# Altium schematic sheet LPCB235 - OPTONCDT - GROUP B.SchDoc
size A3; Address1: Factory 10; Address2: 9-13 Dingley Avenue, Dandeong, VICTORIA 3175, AUSTRALIA; DocumentNumber: 35; Revision: 1; SheetNumber: 35; SheetTotal: 37; Lockie__PCB_SUB_ASSEMBLY: OptoNCDT Group B; Lockie__PCB_ASSEMBLY: FCU PCB; Lockie__LDL: LPCB235; Lockie__PCB_DESCRIPTION: Flight Control Unit
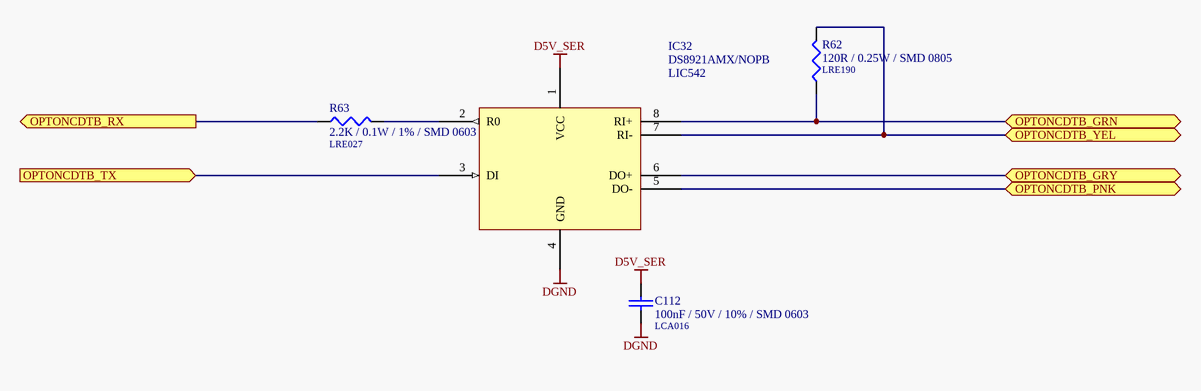
[diagram p0: LPCB235 - OPTONCDT - GROUP B.SchDoc]

## Parts
C112  100nF / 50V / 10% / SMD 0603  LDL_NUMBER: LCA016  [LFP011__CC1608-0603-IPC7351_B]
IC32  DS8921AMX/NOPB  LDL_NUMBER: LIC542  [LFP069__R-8G]
R62  120R / 0.25W / SMD 0805  LDL_NUMBER: LRE190  [LFP029__CR2012-0805]
R63  2.2K / 0.1W / 1% / SMD 0603  LDL_NUMBER: LRE027  [LFP020__CR1608-0603-IPC7351_B]

## Ports
OPTONCDTB_GRN (bidir), OPTONCDTB_GRY (bidir), OPTONCDTB_PNK (bidir), OPTONCDTB_RX (out), OPTONCDTB_TX (in), OPTONCDTB_YEL (bidir)

## Nets
D5V_SER: C112.1 IC32.1(VCC)
DGND: C112.2 IC32.4(GND)
OPTONCDTB_GRN: IC32.8(RI+) R62.1 ; port OPTONCDTB_GRN
OPTONCDTB_GRY: IC32.6(DO+) ; port OPTONCDTB_GRY
OPTONCDTB_PNK: IC32.5(DO-) ; port OPTONCDTB_PNK
OPTONCDTB_RX: R63.1 ; port OPTONCDTB_RX
OPTONCDTB_TX: IC32.3(DI) ; port OPTONCDTB_TX
OPTONCDTB_YEL: IC32.7(RI-) R62.2 ; port OPTONCDTB_YEL
NetIC32_2: IC32.2(R0) R63.2

## Notes on the sheet
- PCB COMPONENT DESCRIPTION
- LDL NUMBER
- Assembly Details
- Size
- Drawing File Name
- Revision
- http://rloop.org
- Scale
- A3
- Sheet Details
- N.T.S
- Sheet:
- Of:

## Library data of the parts
C112 = 100nF / 50V / 10% / SMD 0603: Capacitor, Ceramic Chip, 100nF (0.1uF), 50V, 5%, SMD 0603 [LCA016]; Value: 100n; FMEDA__OPERATING__VOLTAGE_MIN: 0; FMEDA__OPERATING__VOLTAGE_MAX: 3.3; FMEDA__OPERATING__TEMP_MIN: -20; FMEDA__OPERATING__TEMP_TYP: 27; FMEDA__OPERATING__TEMP_MAX: 50; FMEDA__CHANNEL: COM; FMEDA__FUNCTION_IN_SYSTEM: *; FMEDA__OPERATING__VOLTAGE_TYP: 3.3
IC32 = DS8921AMX/NOPB: IC, RS422 Tx Rx, SMD SOIC 8
R62 = 120R / 0.25W / SMD 0805: Resistor, Thick Film, 120R, 0.25W, 5%, SMD 0805 [LRE190]; Value: 120; FMEDA__OPERATING__POWER_MAX: 0; FMEDA__OPERATING__TEMP_MAX: 155; FMEDA__OPERATING__TEMP_MIN: -55; FMEDA__OPERATING__TEMP_TYP: 27; FMEDA__OPERATING__VOLTAGE_TYP: 150; FMEDA__CHANNEL: COM; FMEDA__OPERATING__POWER_MIN: 0; FMEDA__OPERATING__VOLTAGE_MAX: 0; FMEDA__OPERATING__VOLTAGE_MIN: 0; FMEDA__FUNCTION_IN_SYSTEM: *
R63 = 2.2K / 0.1W / 1% / SMD 0603: Resistor, Ceramic Chip, 2.2K, 0.1W, 1%, SMD 0603 [LRE027]; FMEDA__OPERATING__VOLTAGE_MIN: 0; FMEDA__OPERATING__TEMP_MIN: -20; FMEDA__OPERATING__TEMP_TYP: 27; FMEDA__OPERATING__TEMP_MAX: 50; FMEDA__CHANNEL: COM; VALUE: 2.2K; FMEDA__OPERATING__VOLTAGE_MAX: 0; FMEDA__OPERATING__POWER_MIN: 0; FMEDA__OPERATING__POWER_MAX: 0; FMEDA__FUNCTION_IN_SYSTEM: *; FMEDA__OPERATING__VOLTAGE_TYP: 0